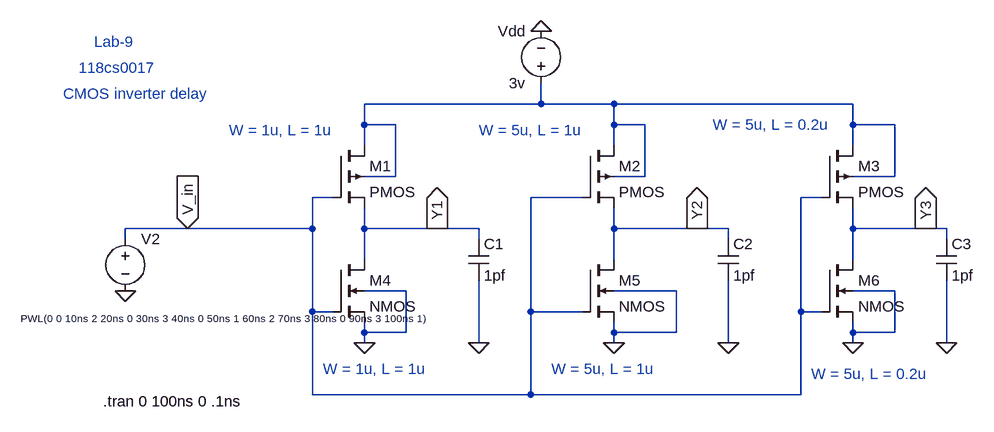
[diagram p0: schematic Draft19.asc]
Draft19.asc, the LTspice schematic file:
Version 4
SHEET 1 1056 680
WIRE 384 0 384 -32
WIRE 384 0 112 0
WIRE 496 0 384 0
WIRE 864 0 496 0
WIRE 112 32 112 0
WIRE 160 32 112 32
WIRE 496 32 496 0
WIRE 544 32 496 32
WIRE 864 32 864 0
WIRE 928 32 864 32
WIRE 112 64 112 32
WIRE 496 64 496 32
WIRE 864 64 864 32
WIRE 160 112 160 32
WIRE 160 112 112 112
WIRE 544 112 544 32
WIRE 544 112 496 112
WIRE 928 112 928 32
WIRE 928 112 864 112
WIRE 64 144 32 144
WIRE 448 144 368 144
WIRE 816 144 784 144
WIRE -160 192 -256 192
WIRE 32 192 32 144
WIRE 32 192 -160 192
WIRE 112 192 112 160
WIRE 224 192 112 192
WIRE 288 192 224 192
WIRE 496 192 496 160
WIRE 624 192 496 192
WIRE 672 192 624 192
WIRE 864 192 864 160
WIRE 976 192 864 192
WIRE 1008 192 976 192
WIRE -256 208 -256 192
WIRE 288 208 288 192
WIRE 672 208 672 192
WIRE 1008 208 1008 192
WIRE 112 240 112 192
WIRE 496 240 496 192
WIRE 864 240 864 192
WIRE 176 288 112 288
WIRE 592 288 496 288
WIRE 928 288 864 288
WIRE 32 320 32 192
WIRE 64 320 32 320
WIRE 368 320 368 144
WIRE 448 320 368 320
WIRE 784 320 784 144
WIRE 816 320 784 320
WIRE 112 352 112 336
WIRE 176 352 176 288
WIRE 176 352 112 352
WIRE 496 352 496 336
WIRE 592 352 592 288
WIRE 592 352 496 352
WIRE 864 352 864 336
WIRE 928 352 928 288
WIRE 928 352 864 352
WIRE 112 368 112 352
WIRE 288 368 288 272
WIRE 496 368 496 352
WIRE 672 368 672 272
WIRE 864 368 864 352
WIRE 1008 368 1008 272
WIRE 32 448 32 320
WIRE 368 448 368 320
WIRE 368 448 32 448
WIRE 784 448 784 320
WIRE 784 448 368 448
FLAG 384 -112 0
FLAG 112 368 0
FLAG 288 368 0
FLAG 496 368 0
FLAG 672 368 0
FLAG 864 368 0
FLAG 1008 368 0
FLAG 224 192 Y1
IOPIN 224 192 Out
FLAG 624 192 Y2
IOPIN 624 192 Out
FLAG 976 192 Y3
IOPIN 976 192 Out
FLAG -256 288 0
FLAG -160 192 V_in
IOPIN -160 192 In
SYMBOL pmos4 64 64 R0
SYMATTR InstName M1
SYMATTR Value2 l=1u w=1u
SYMBOL pmos4 448 64 R0
SYMATTR InstName M2
SYMATTR Value2 l=1u w=5u
SYMBOL pmos4 816 64 R0
SYMATTR InstName M3
SYMATTR Value2 l=0.2u w=5u
SYMBOL nmos4 64 240 R0
SYMATTR InstName M4
SYMATTR Value2 l=1u w=1u
SYMBOL nmos4 448 240 R0
SYMATTR InstName M5
SYMATTR Value2 l=1u w=5u
SYMBOL nmos4 816 240 R0
SYMATTR InstName M6
SYMATTR Value2 l=0.2u w=5u
SYMBOL voltage 384 -16 R180
WINDOW 0 24 96 Left 2
WINDOW 3 24 16 Left 2
SYMATTR InstName Vdd
SYMATTR Value 3v
SYMBOL cap 272 208 R0
SYMATTR InstName C1
SYMATTR Value 1pf
SYMBOL cap 656 208 R0
SYMATTR InstName C2
SYMATTR Value 1pf
SYMBOL cap 992 208 R0
SYMATTR InstName C3
SYMATTR Value 1pf
SYMBOL voltage -256 192 R0
WINDOW 3 -161 138 Left 1
WINDOW 123 0 0 Left 0
WINDOW 39 0 0 Left 0
SYMATTR InstName V2
SYMATTR Value PWL(0 0 10ns 2 20ns 0 30ns 3 40ns 0 50ns 1 60ns 2 70ns 3 80ns 0 90ns 3 100ns 1)
TEXT -96 40 Left 2 ;W = 1u, L = 1u
TEXT 288 40 Left 2 ;W = 5u, L = 1u
TEXT 648 32 Left 2 ;W = 5u, L = 0.2u
TEXT 48 408 Left 2 ;W = 1u, L = 1u
TEXT 400 408 Left 2 ;W = 5u, L = 1u
TEXT 800 416 Left 2 ;W = 5u, L = 0.2u
TEXT -290 458 Left 2 !.tran 0 100ns 0 .1ns
TEXT -328 -56 Left 2 ;118cs0017
TEXT -304 -96 Left 2 ;Lab-9
TEXT -352 -16 Left 2 ;CMOS inverter delay

The netlist it stands for:
* Draft19.asc
M1 N001 V_in Y1 N001 PMOS l=1u w=1u
M2 N001 V_in Y2 N001 PMOS l=1u w=5u
M3 N001 V_in Y3 N001 PMOS l=0.2u w=5u
M4 Y1 V_in 0 0 NMOS l=1u w=1u
M5 Y2 V_in 0 0 NMOS l=1u w=5u
M6 Y3 V_in 0 0 NMOS l=0.2u w=5u
Vdd N001 0 3v
C1 Y1 0 1pf
C2 Y2 0 1pf
C3 Y3 0 1pf
V2 V_in 0 PWL(0 0 10ns 2 20ns 0 30ns 3 40ns 0 50ns 1 60ns 2 70ns 3 80ns 0 90ns 3 100ns 1)
.model NMOS NMOS
.model PMOS PMOS
.lib standard.mos
* W = 1u, L = 1u
* W = 5u, L = 1u
* W = 5u, L = 0.2u
* W = 1u, L = 1u
* W = 5u, L = 1u
* W = 5u, L = 0.2u
.tran 0 100ns 0 .1ns
* 118cs0017
* Lab-9
* CMOS inverter delay
.backanno
.end